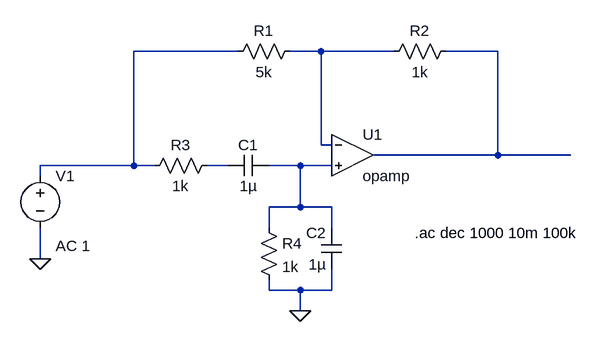
[diagram p0: schematic Semanal#0Bonus3.asc]
Semanal#0Bonus3.asc, the LTspice schematic file:
Version 4
SHEET 1 880 680
WIRE 32 16 -128 16
WIRE 160 16 112 16
WIRE 272 16 160 16
WIRE 432 16 352 16
WIRE 160 160 160 16
WIRE 176 160 160 160
WIRE 432 176 432 16
WIRE 432 176 240 176
WIRE 544 176 432 176
WIRE -128 192 -128 16
WIRE -128 192 -272 192
WIRE -96 192 -128 192
WIRE 16 192 -16 192
WIRE 128 192 80 192
WIRE 176 192 128 192
WIRE -272 208 -272 192
WIRE 128 256 128 192
WIRE 128 256 80 256
WIRE 176 256 128 256
WIRE 80 288 80 256
WIRE 176 288 176 256
WIRE -272 336 -272 288
WIRE 80 384 80 368
WIRE 128 384 80 384
WIRE 176 384 176 352
WIRE 176 384 128 384
WIRE 128 416 128 384
FLAG 128 416 0
FLAG -272 336 0
SYMBOL opamp 208 112 R0
SYMATTR InstName U1
SYMBOL res 128 0 R90
WINDOW 0 0 56 VBottom 2
WINDOW 3 32 56 VTop 2
SYMATTR InstName R1
SYMATTR Value 5k
SYMBOL res 368 0 R90
WINDOW 0 0 56 VBottom 2
WINDOW 3 32 56 VTop 2
SYMATTR InstName R2
SYMATTR Value 1k
SYMBOL res 0 176 R90
WINDOW 0 0 56 VBottom 2
WINDOW 3 32 56 VTop 2
SYMATTR InstName R3
SYMATTR Value 1k
SYMBOL cap 80 176 R90
WINDOW 0 0 32 VBottom 2
WINDOW 3 32 32 VTop 2
SYMATTR InstName C1
SYMATTR Value 1µ
SYMBOL cap 192 352 R180
WINDOW 0 24 56 Left 2
WINDOW 3 24 8 Left 2
SYMATTR InstName C2
SYMATTR Value 1µ
SYMBOL res 64 272 R0
SYMATTR InstName R4
SYMATTR Value 1k
SYMBOL voltage -272 192 R0
WINDOW 123 24 124 Left 2
WINDOW 39 0 0 Left 0
SYMATTR Value2 AC 1
SYMATTR InstName V1
SYMATTR Value ""
TEXT 304 296 Left 2 !.ac dec 1000 10m 100k

The netlist it stands for:
* Semanal#0Bonus3.asc
XU1 N002 N005 N003 opamp Aol=100K GBW=10Meg  ; pins invin noninvin out
R1 N002 N001 5k
R2 N003 N002 1k
R3 N004 N001 1k
C1 N005 N004 1µ
C2 0 N005 1µ
R4 N005 0 1k
V1 N001 0 AC 1
.ac dec 1000 10m 100k
.backanno
.end